# Altium project SpectrumAnalizer.PrjPcb (part 2 of 2)

## Sheet Analog.SchDoc
size A2
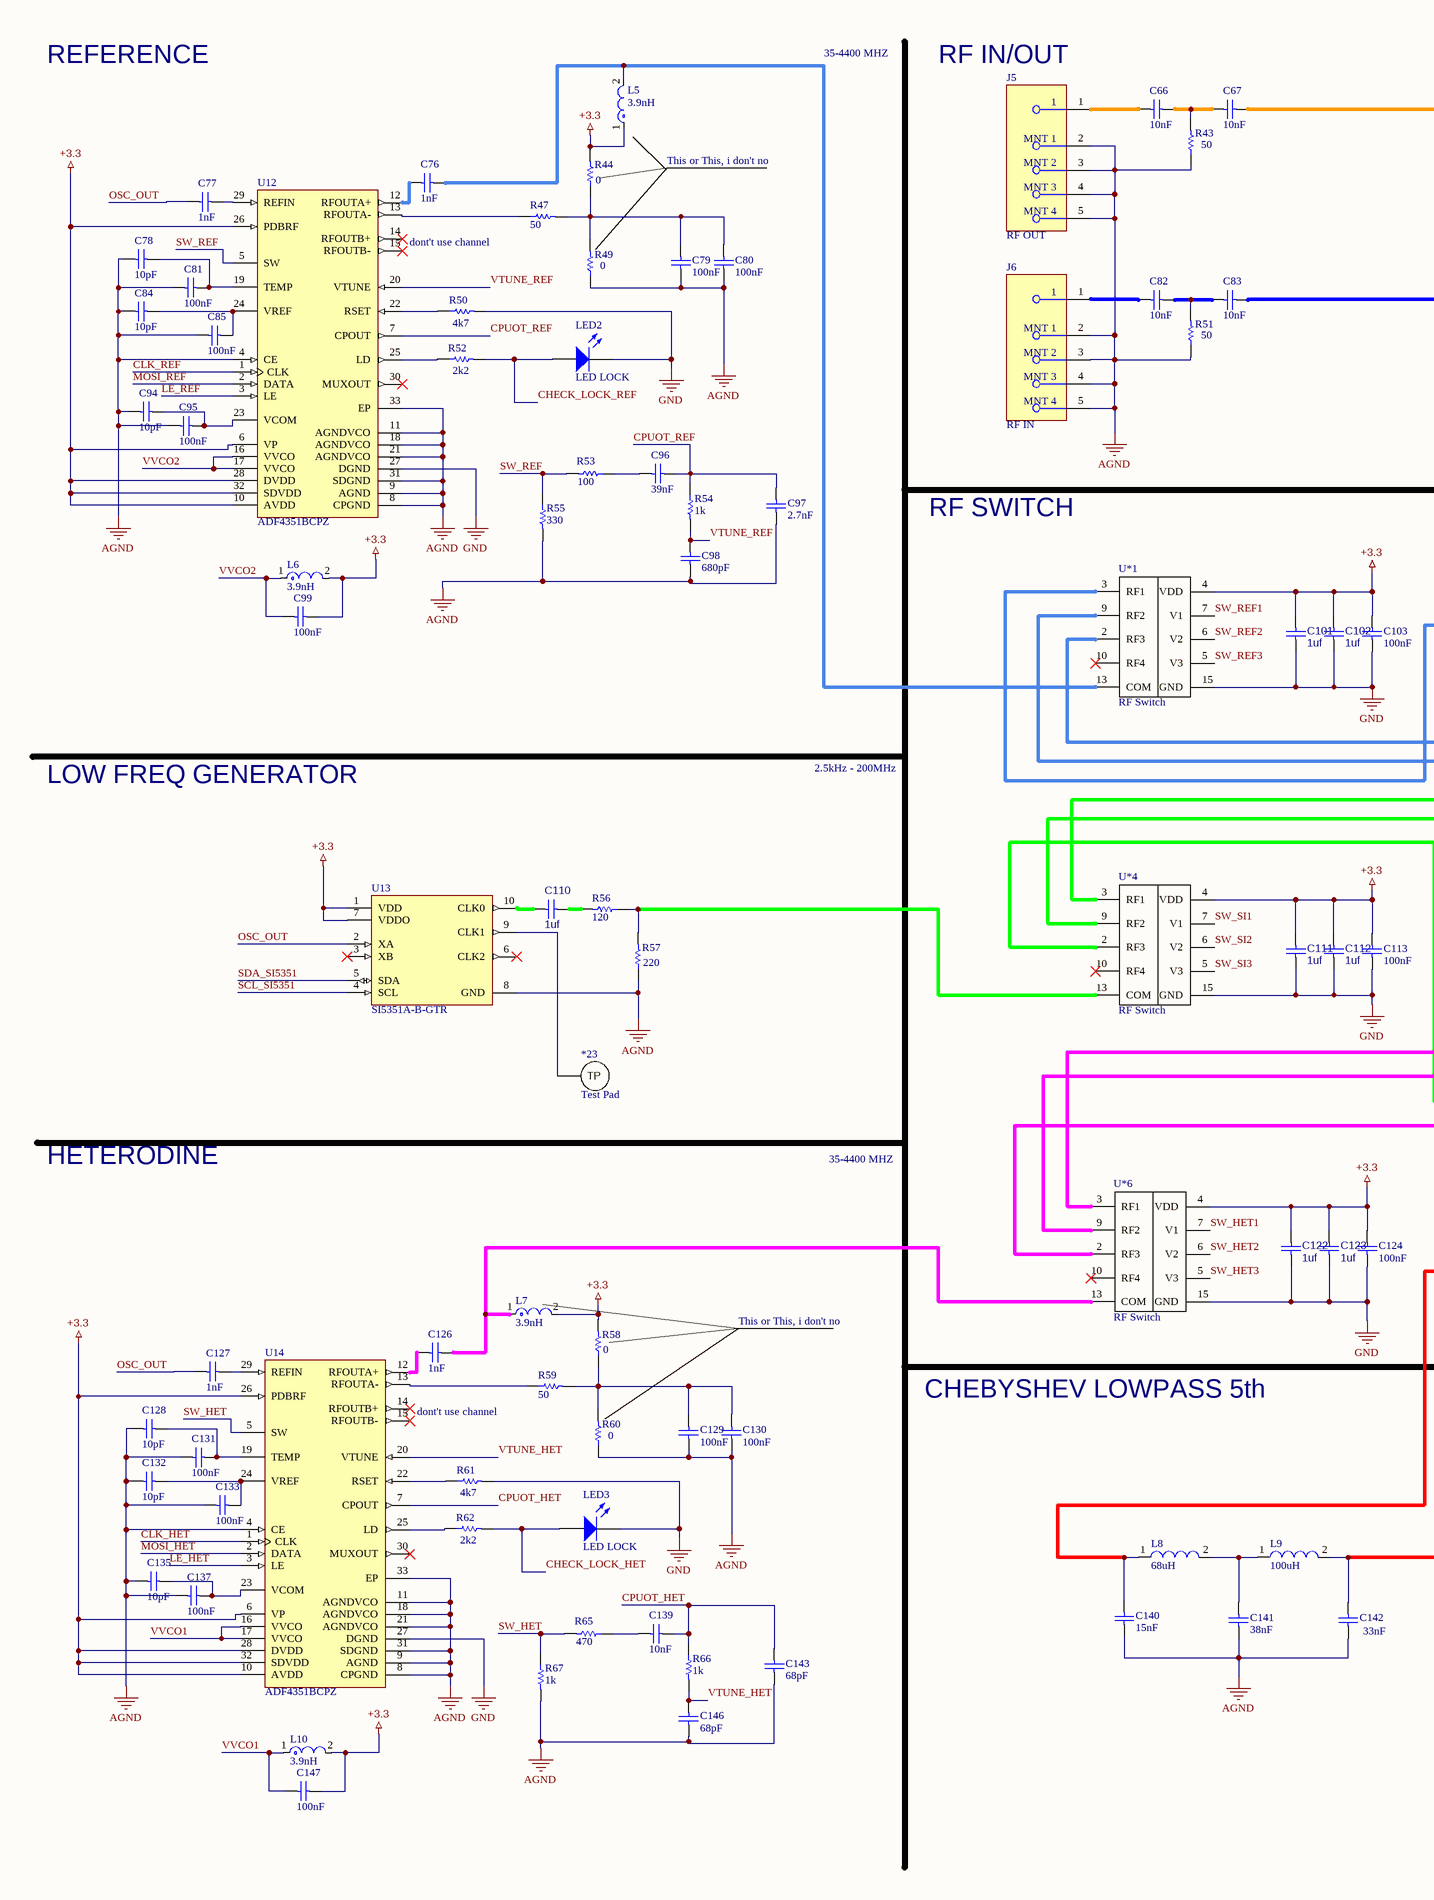
[diagram p3: Analog.SchDoc, left]
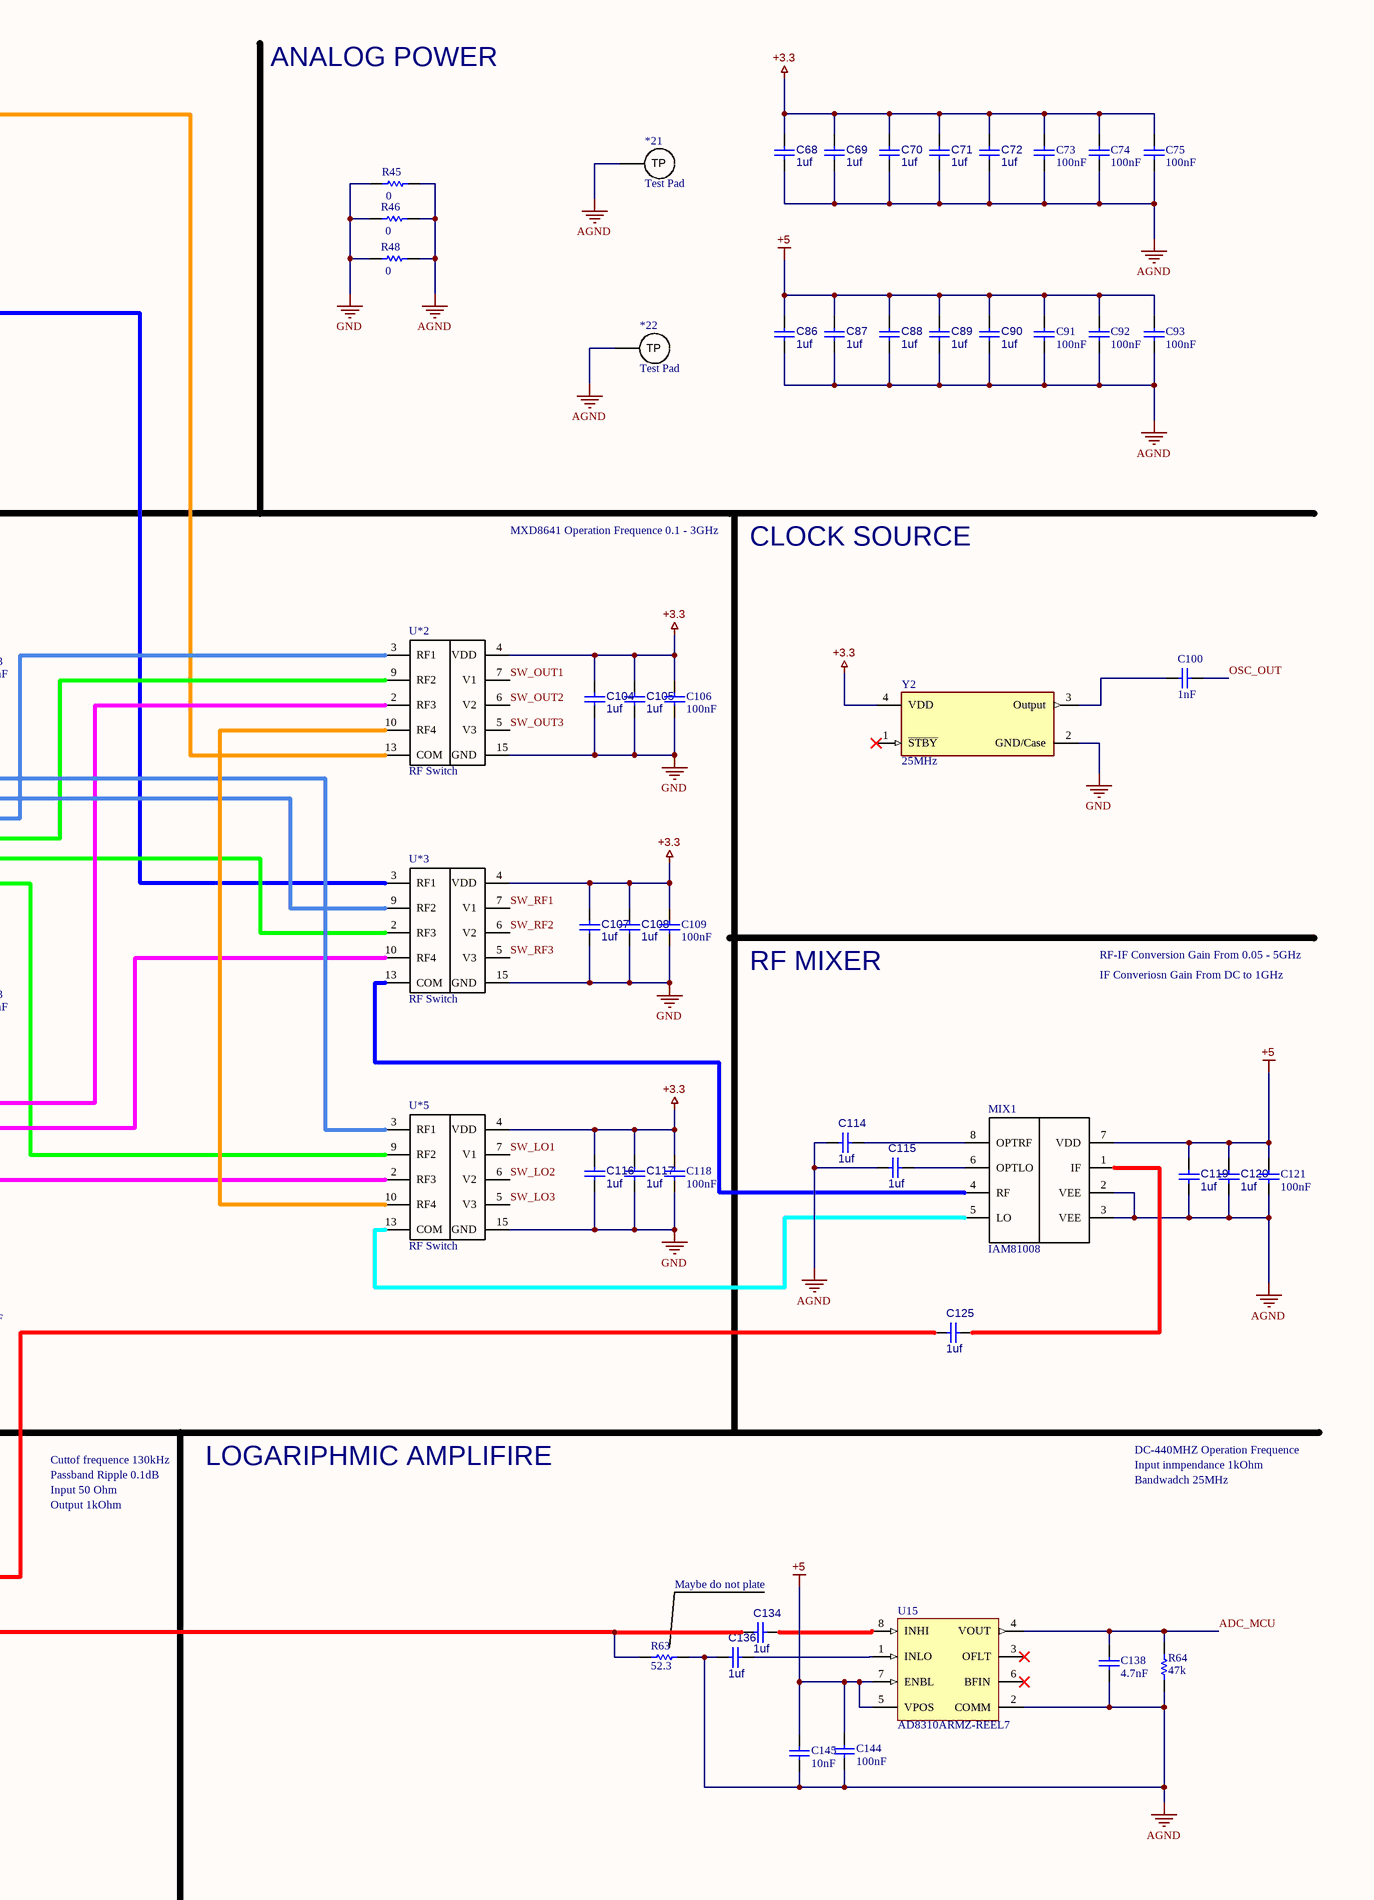
[diagram p4: Analog.SchDoc, right]

### Parts
*21  Test Pad  [Test Pad]
*22  Test Pad  [Test Pad]
*23  Test Pad  [Test Pad]
C66  10nF  [CAPC1608X90X35ML10T15]
C67  10nF  [CAPC1608X90X35ML10T15]
C68  1uf  [CAPC2013X70X45NL10T25]
C69  1uf  [CAPC2013X70X45NL10T25]
C70  1uf  [CAPC2013X70X45NL10T25]
C71  1uf  [CAPC2013X70X45NL10T25]
C72  1uf  [CAPC2013X70X45NL10T25]
C73  100nF  [CAPC1608X90X35ML10T15]
C74  100nF  [CAPC1608X90X35ML10T15]
C75  100nF  [CAPC1608X90X35ML10T15]
C76  1nF  [CAPC1608X90X35ML10T15]
C77  1nF  [CAPC1608X90X35ML10T15]
C78  10pF  [CAPC1608X90X35ML10T15]
C79  100nF  [CAPC1608X90X35ML10T15]
C80  100nF  [CAPC1608X90X35ML10T15]
C81  100nF  [CAPC1608X90X35ML10T15]
C82  10nF  [CAPC1608X90X35ML10T15]
C83  10nF  [CAPC1608X90X35ML10T15]
C84  10pF  [CAPC1608X90X35ML10T15]
C85  100nF  [CAPC1608X90X35ML10T15]
C86  1uf  [CAPC2013X70X45NL10T25]
C87  1uf  [CAPC2013X70X45NL10T25]
C88  1uf  [CAPC2013X70X45NL10T25]
C89  1uf  [CAPC2013X70X45NL10T25]
C90  1uf  [CAPC2013X70X45NL10T25]
C91  100nF  [CAPC1608X90X35ML10T15]
C92  100nF  [CAPC1608X90X35ML10T15]
C93  100nF  [CAPC1608X90X35ML10T15]
C94  10pF  [CAPC1608X90X35ML10T15]
C95  100nF  [CAPC1608X90X35ML10T15]
C96  39nF  [CAPC1608X90X35ML10T15]
C97  2.7nF  [CAPC1608X90X35ML10T15]
C98  680pF  [CAPC1608X90X35ML10T15]
C99  100nF  [CAPC1608X90X35ML10T15]
C100  1nF  [CAPC1608X90X35ML10T15]
C101  1uf  [CAPC2013X70X45NL10T25]
C102  1uf  [CAPC2013X70X45NL10T25]
C103  100nF  [CAPC1608X90X35ML10T15]
C104  1uf  [CAPC2013X70X45NL10T25]
C105  1uf  [CAPC2013X70X45NL10T25]
C106  100nF  [CAPC1608X90X35ML10T15]
C107  1uf  [CAPC2013X70X45NL10T25]
C108  1uf  [CAPC2013X70X45NL10T25]
C109  100nF  [CAPC1608X90X35ML10T15]
C110  1uf  [CAPC2013X70X45NL10T25]
C111  1uf  [CAPC2013X70X45NL10T25]
C112  1uf  [CAPC2013X70X45NL10T25]
C113  100nF  [CAPC1608X90X35ML10T15]
C114  1uf  [CAPC2013X70X45NL10T25]
C115  1uf  [CAPC2013X70X45NL10T25]
C116  1uf  [CAPC2013X70X45NL10T25]
C117  1uf  [CAPC2013X70X45NL10T25]
C118  100nF  [CAPC1608X90X35ML10T15]
C119  1uf  [CAPC2013X70X45NL10T25]
C120  1uf  [CAPC2013X70X45NL10T25]
C121  100nF  [CAPC1608X90X35ML10T15]
C122  1uf  [CAPC2013X70X45NL10T25]
C123  1uf  [CAPC2013X70X45NL10T25]
C124  100nF  [CAPC1608X90X35ML10T15]
C125  1uf  [CAPC2013X70X45NL10T25]
C126  1nF  [CAPC1608X90X35ML10T15]
C127  1nF  [CAPC1608X90X35ML10T15]
C128  10pF  [CAPC1608X90X35ML10T15]
C129  100nF  [CAPC1608X90X35ML10T15]
C130  100nF  [CAPC1608X90X35ML10T15]
C131  100nF  [CAPC1608X90X35ML10T15]
C132  10pF  [CAPC1608X90X35ML10T15]
C133  100nF  [CAPC1608X90X35ML10T15]
C134  1uf  [CAPC2013X70X45NL10T25]
C135  10pF  [CAPC1608X90X35ML10T15]
C136  1uf  [CAPC2013X70X45NL10T25]
C137  100nF  [CAPC1608X90X35ML10T15]
C138  4.7nF  [CAPC1608X90X35ML10T15]
C139  10nF  [CAPC1608X90X35ML10T15]
C140  15nF  [CAPC1608X90X35ML10T15]
C141  38nF  [CAPC1608X90X35ML10T15]
C142  33nF  [CAPC1608X90X35ML10T15]
C143  68pF  [CAPC1608X90X35ML10T15]
C144  100nF  [CAPC1608X90X35ML10T15]
C145  10nF  [CAPC1608X90X35ML10T15]
C146  68pF  [CAPC1608X90X35ML10T15]
C147  100nF  [CAPC1608X90X35ML10T15]
J5  RF OUT  [FP-73251-1350-MFG]
J6  RF IN  [FP-73251-1350-MFG]
L5  3.9nH  [FP-LQG18HH_00-MFG]
L6  3.9nH  [FP-LQG18HH_00-MFG]
L7  3.9nH  [FP-LQG18HH_00-MFG]
L8  68uH  [SMD-1210]
L9  100uH  [SMD-1210]
L10  3.9nH  [FP-LQG18HH_00-MFG]
LED2  LED LOCK  [0805_A]
LED3  LED LOCK  [0805_A]
MIX1  IAM81008  [IAM81008]
R43  50  [RESC1608X50X30NL20T20]
R44  0  [RESC1608X50X30NL20T20]
R45  0  [RESC1608X50X30NL20T20]
R46  0  [RESC1608X50X30NL20T20]
R47  50  [RESC1608X50X30NL20T20]
R48  0  [RESC1608X50X30NL20T20]
R49  0  [RESC1608X50X30NL20T20]
R50  4k7  [RESC1608X50X30NL20T20]
R51  50  [RESC1608X50X30NL20T20]
R52  2k2  [RESC1608X50X30NL20T20]
R53  100  [RESC1608X50X30NL20T20]
R54  1k  [RESC1608X50X30NL20T20]
R55  330  [RESC1608X50X30NL20T20]
R56  120  [RESC1608X50X30NL20T20]
R57  220  [RESC1608X50X30NL20T20]
R58  0  [RESC1608X50X30NL20T20]
R59  50  [RESC1608X50X30NL20T20]
R60  0  [RESC1608X50X30NL20T20]
R61  4k7  [RESC1608X50X30NL20T20]
R62  2k2  [RESC1608X50X30NL20T20]
R63  52.3  [RESC1608X50X30NL20T20]
R64  47k  [RESC1608X50X30NL20T20]
R65  470  [RESC1608X50X30NL20T20]
R66  1k  [RESC1608X50X30NL20T20]
R67  1k  [RESC1608X50X30NL20T20]
U12  ADF4351BCPZ  [ADI-CP-32-2_N]
U13  SI5351A-B-GTR  [FP-SI5351A-B-GTR-MFG]
U14  ADF4351BCPZ  [ADI-CP-32-2_N]
U15  AD8310ARMZ-REEL7  [ADI-RM-8_N]
U*1  RF Switch  [PCBComponent_1]
U*2  RF Switch  [PCBComponent_1]
U*3  RF Switch  [PCBComponent_1]
U*4  RF Switch  [PCBComponent_1]
U*5  RF Switch  [PCBComponent_1]
U*6  RF Switch  [PCBComponent_1]
Y2  25MHz  [FP-ASE-MFG]

### Nets
+3.3: C68.2 C69.2 C70.2 C71.2 C72.2 C73.2 C74.2 C75.2 C99.2 C101.2 C102.2 C103.2 C104.2 C105.2 C106.2 C107.2 C108.2 C109.2 C111.2 C112.2 C113.2 C116.2 C117.2 C118.2 C122.2 C123.2 C124.2 C147.2 L5.1 L6.2 L7.2 L10.2 R44.2 R58.2 U12.6(VP) U12.10(AVDD) U12.26(PDBRF) U12.28(DVDD) U12.32(SDVDD) U13.1(VDD) U13.7(VDDO) U14.6(VP) U14.10(AVDD) U14.26(PDBRF) U14.28(DVDD) U14.32(SDVDD) U*1.4(VDD) U*2.4(VDD) U*3.4(VDD) U*4.4(VDD) U*5.4(VDD) U*6.4(VDD) Y2.4(VDD)
+5: C86.2 C87.2 C88.2 C89.2 C90.2 C91.2 C92.2 C93.2 C119.2 C120.2 C121.2 C144.2 C145.2 MIX1.7(VDD) U15.5(VPOS) U15.7(ENBL)
AGND: *21.1(TP) *22.1(TP) C68.1 C69.1 C70.1 C71.1 C72.1 C73.1 C74.1 C75.1 C78.1 C79.1 C80.1 C81.1 C84.1 C85.1 C86.1 C87.1 C88.1 C89.1 C90.1 C91.1 C92.1 C93.1 C94.1 C95.1 C97.1 C98.1 C114.2 C115.2 C119.1 C120.1 C121.1 C128.1 C129.1 C130.1 C131.1 C132.1 C133.1 C135.1 C136.2 C137.1 C138.1 C140.1 C141.1 C142.1 C143.1 C144.1 C145.1 C146.1 J5.2(MNT_1) J5.3(MNT_2) J5.4(MNT_3) J5.5(MNT_4) J6.2(MNT_1) J6.3(MNT_2) J6.4(MNT_3) J6.5(MNT_4) MIX1.2(VEE) MIX1.3(VEE) R43.1 R45.2 R46.2 R48.2 R49.1 R51.1 R55.2 R57.1 R60.1 R63.2 R64.1 R67.2 U12.4(CE) U12.8(CPGND) U12.9(AGND) U12.11(AGNDVCO) U12.18(AGNDVCO) U12.21(AGNDVCO) U12.31(SDGND) U12.33(EP) U13.8(GND) U14.4(CE) U14.8(CPGND) U14.9(AGND) U14.11(AGNDVCO) U14.18(AGNDVCO) U14.21(AGNDVCO) U14.31(SDGND) U14.33(EP) U15.2(COMM)
GND: C101.1 C102.1 C103.1 C104.1 C105.1 C106.1 C107.1 C108.1 C109.1 C111.1 C112.1 C113.1 C116.1 C117.1 C118.1 C122.1 C123.1 C124.1 LED2.1(K) LED3.1(K) R45.1 R46.1 R48.1 R50.2 R61.2 U12.27(DGND) U14.27(DGND) U*1.15(GND) U*2.15(GND) U*3.15(GND) U*4.15(GND) U*5.15(GND) U*6.15(GND) Y2.2(GND/Case)
ADC_MCU: C138.2 R64.2 U15.4(VOUT)
CHECK_LOCK_HET: LED3.2(A) R62.2
CHECK_LOCK_REF: LED2.2(A) R52.2
CLK_HET: U12.1(CLK) U14.1(CLK)  [also labelled CLK_REF]
CPUOT_HET: C139.2 C143.2 R66.1 U14.7(CPOUT)
CPUOT_REF: C96.2 C97.2 R54.1 U12.7(CPOUT)
LE_HET: U14.3(LE)
LE_REF: U12.3(LE)
MOSI_HET: U12.2(DATA) U14.2(DATA)  [also labelled MOSI_REF]
OSC_OUT: C77.1 C100.2 C127.1 U13.2(XA)
SCL_SI5351: U13.4(SCL)
SDA_SI5351: U13.5(SDA)
SW_HET: R65.2 R67.1 U14.5(SW)
SW_HET1: U*6.7(V1)
SW_HET2: U*6.6(V2)
SW_HET3: U*6.5(V3)
SW_LO1: U*5.7(V1)
SW_LO2: U*5.6(V2)
SW_LO3: U*5.5(V3)
SW_OUT1: U*2.7(V1)
SW_OUT2: U*2.6(V2)
SW_OUT3: U*2.5(V3)
SW_REF: R53.2 R55.1 U12.5(SW)
SW_REF1: U*1.7(V1)
SW_REF2: U*1.6(V2)
SW_REF3: U*1.5(V3)
SW_RF1: U*3.7(V1)
SW_RF2: U*3.6(V2)
SW_RF3: U*3.5(V3)
SW_SI1: U*4.7(V1)
SW_SI2: U*4.6(V2)
SW_SI3: U*4.5(V3)
VTUNE_HET: C146.2 R66.2 U14.20(VTUNE)
VTUNE_REF: C98.2 R54.2 U12.20(VTUNE)
VVCO1: C147.1 L10.1 U14.16(VVCO) U14.17(VVCO)
VVCO2: C99.1 L6.1 U12.16(VVCO) U12.17(VVCO)
Net*23_1: *23.1(TP) U13.9(CLK1)
NetC66_1: C66.1 C67.2 R43.2
NetC66_2: C66.2 J5.1
NetC67_1: C67.1 U*2.13(COM)
NetC76_1: C76.1 U12.12(RFOUTA+)
NetC76_2: C76.2 L5.2 U*1.13(COM)
NetC77_2: C77.2 U12.29(REFIN)
NetC78_2: C78.2 C81.2 U12.19(TEMP)
NetC79_2: C79.2 C80.2 R44.1 R47.2 R49.2
NetC82_1: C82.1 C83.2 R51.2
NetC82_2: C82.2 J6.1
NetC83_1: C83.1 U*3.3(RF1)
NetC84_2: C84.2 C85.2 U12.24(VREF)
NetC94_2: C94.2 C95.2 U12.23(VCOM)
NetC96_1: C96.1 R53.1
NetC100_1: C100.1 Y2.3(Output)
NetC110_1: C110.1 R56.2
NetC110_2: C110.2 U13.10(CLK0)
NetC114_1: C114.1 MIX1.8(OPTRF)
NetC115_1: C115.1 MIX1.6(OPTLO)
NetC125_1: C125.1 MIX1.1(IF)
NetC125_2: C125.2 C140.2 L8.1
NetC126_1: C126.1 U14.12(RFOUTA+)
NetC126_2: C126.2 L7.1 U*6.13(COM)
NetC127_2: C127.2 U14.29(REFIN)
NetC128_2: C128.2 C131.2 U14.19(TEMP)
NetC129_2: C129.2 C130.2 R58.1 R59.2 R60.2
NetC132_2: C132.2 C133.2 U14.24(VREF)
NetC134_1: C134.1 U15.8(INHI)
NetC134_2: C134.2 C142.2 L9.2 R63.1
NetC135_2: C135.2 C137.2 U14.23(VCOM)
NetC136_1: C136.1 U15.1(INLO)
NetC139_1: C139.1 R65.1
NetC141_2: C141.2 L8.2 L9.1
NetMIX1_4: MIX1.4(RF) U*3.13(COM)
NetMIX1_5: MIX1.5(LO) U*5.13(COM)
NetR47_1: R47.1 U12.13(RFOUTA-)
NetR50_1: R50.1 U12.22(RSET)
NetR52_1: R52.1 U12.25(LD)
NetR56_1: R56.1 R57.2 U*4.13(COM)
NetR59_1: R59.1 U14.13(RFOUTA-)
NetR61_1: R61.1 U14.22(RSET)
NetR62_1: R62.1 U14.25(LD)
NetU*1_2: U*1.2(RF3) U*5.3(RF1)
NetU*1_3: U*1.3(RF1) U*2.3(RF1)
NetU*1_9: U*1.9(RF2) U*3.9(RF2)
NetU*2_2: U*2.2(RF3) U*6.3(RF1)
NetU*2_9: U*2.9(RF2) U*4.3(RF1)
NetU*2_10: U*2.10(RF4) U*5.10(RF4)
NetU*3_2: U*3.2(RF3) U*4.9(RF2)
NetU*3_10: U*3.10(RF4) U*6.9(RF2)
NetU*4_2: U*4.2(RF3) U*5.9(RF2)
NetU*5_2: U*5.2(RF3) U*6.2(RF3)

Not connected (* = marked no-connect by the designer): U12 14(RFOUTB+)* 15(RFOUTB-)* 30(MUXOUT)*; U13 3(XB)* 6(CLK2)*; U14 14(RFOUTB+)* 15(RFOUTB-)* 30(MUXOUT)*; U15 3(OFLT)* 6(BFIN)*; U*1 10(RF4)*; U*4 10(RF4)*; U*6 10(RF4)*; Y2 1(~{STBY})*

### Notes on the sheet
- REFERENCE
- 35-4400 MHZ
- (near J5) RF IN/OUT
- ANALOG POWER
- This or This, i don't no
- dont't use channel
- RF SWITCH
- MXD8641 Operation Frequence 0.1 - 3GHz
- CLOCK SOURCE
- 2.5kHz - 200MHz
- LOW FREQ GENERATOR
- RF MIXER
- RF-IF Conversion Gain From 0.05 - 5GHz
- IF Converiosn Gain From DC to 1GHz
- HETERODINE
- DC-440MHZ Operation Frequence
- CHEBYSHEV LOWPASS 5th
- Input 50 Ohm
- Output 1kOhm
- Cuttof frequence 130kHz
- Passband Ripple 0.1dB
- LOGARIPHMIC AMPLIFIRE
- Input inmpendance 1kOhm
- Bandwadch 25MHz
- (near C134) Maybe do not plate

### Library data of the parts
C66 C67 C82 C83 C139 C145 = CMP-2100-03642-1: Chip Capacitor, 10 nF, +/- 10%, 50 V, -55 to 125 degC, 0603 (1608 Metric), RoHS, Tape and Reel; Manufacturer: Murata; Insulation Resistance: 10GR; Dielectric: X7R; Voltage Rating: 50V; Material: Ceramic; Package Quantity: 1; Lead Free: LeadFree; Case/Package: 0603; Termination: SMD/SMT; REACH SVHC: Unknown; Manufacturer URL: http://www.murata.com/; Datasheet URL: http://search.murata.co.jp/Ceramy/image/img/A01X/G101/ENG/GRM188R71H103KA01-01.pdf; Mount: SurfaceMount; Datasheet Version: 42401.0; Number of Pins: 2; Length: 1.6mm; Voltage: 50V; Depth: 0.8mm; Tolerance: 10%; Min Operating Temperature: -55degC; Voltage Rating (DC): 50V; Max Operating Temperature: 125degC; Package Description: 2-Pin Surface Mount Device, Body 1.6 x 0.8 mm; RoHSCompliant: True; Case Code (Imperial): 0603; Width: 0.031inch; Case Code (Metric): 1608; Height: 0.8mm; Package Reference: 0603; Packaging: TapeandReel; Thickness: 0.035inch; Capacitance: 10nF; Dielectric Material: Ceramic
C68-C72 C86-C90 C101 C102 C104 C105 C107 C108 C110-C112 C114-C117 C119 C120 C122 C123 C125 C134 C136 = CMP-2007-00957-1: Part Number: GRM216R61E105KA12D; Manufacturer: Murata
C73-C81 C84 C85 C91-C100 C103 C106 C109 C113 C118 C121 C124 C126-C133 C135 C137 C138 C140-C144 C146 C147 = CMP-2100-03642-1: Chip Capacitor, 10 nF, +/- 10%, 50 V, -55 to 125 degC, 0603 (1608 Metric), RoHS, Tape and Reel; Manufacturer: Murata; Insulation Resistance: 10GR; Dielectric: X7R; Voltage Rating: 50V; Capacitance: 10nF; Material: Ceramic; Package Quantity: 1; Lead Free: LeadFree; Case/Package: 0603; Termination: SMD/SMT; REACH SVHC: Unknown; Manufacturer URL: http://www.murata.com/; Datasheet URL: http://search.murata.co.jp/Ceramy/image/img/A01X/G101/ENG/GRM188R71H103KA01-01.pdf; Mount: SurfaceMount; Datasheet Version: 42401.0; Number of Pins: 2; Length: 1.6mm; Voltage: 50V; Depth: 0.8mm; Tolerance: 10%; Min Operating Temperature: -55degC; Voltage Rating (DC): 50V; Max Operating Temperature: 125degC; Package Description: 2-Pin Surface Mount Device, Body 1.6 x 0.8 mm; RoHSCompliant: True; Case Code (Imperial): 0603; Width: 0.031inch; Case Code (Metric): 1608; Height: 0.8mm; Package Reference: 0603; Packaging: TapeandReel; Thickness: 0.035inch; Dielectric Material: Ceramic
J5 J6 = CMP-04764-000006-1: CONN SMA JACK STR 50 OHM SMD; Manufacturer Part Number: 73251-1350; Manufacturer: Molex; Is Female: yes; Standoff Height: 0.41mm; Impedance: 50Ω; Number Of Contacts: 1; Conn Orientation: Straight; Voltage Rating: 500V; Shielding: true; Frequency: 18GHz; Package: 73251-1350; Device Class L1: Connectors; Category: Conn; ComponentLink2URL: https://www.molex.com/pdm_docs/sd/732511350_sd.pdf; Automotive: No; Height: 9.655mm; Octopart: https://octopart.com/73251-1350-molex-5414390; Footprint Url: https://forum.upverter.com/uploads/default/original/3X/d/a/daeafa2ce4908d4fc4e49f0b17d7d2c986fce444.pdf; Temperature Range High: +165°C; Device Class L3: unset; Mouser Description: RF Connectors / Coaxial Connectors SMA ST PCB-JCK STD SMT; Lead Free: Yes; Temperature: -65°C to +165°C; RoHS: TRUE; ComponentLink2Description: Datasheet; Device Class L2: RF / Coaxial Connectors; Digikey Description: CONN SMA JACK STR 50 OHM SMD; Contact Material: Gold; Temperature Range Low: -65°C
L5-L7 L10 = CMP-06042-004616-1: Multilayer type RF Inductor 10nH ±5% 0.3Ω 650mA 0603; Test Frequency: 100MHz; Current: 35mA; DC Resistance (DCR): 300mR; Q Factor: 12; DC Current: 400mA; Self Resonant Frequency: 3.5GHz; Core Material: Air; Shielding: Unshielded; Radiation Hardening: No; Case Code (Metric): 1608; Min Operating Temperature: -40°C; Inductance: 10nH; Inductance Tolerance: 5%; Case Code (Imperial): 0603; Termination: SMD/SMT; Height: 0.8mm; Packaging: Tape and Reel; Width: 0.031inch; Military Standard: Not; Max DC Current: 400mA; Max Operating Temperature: 85°C; Package Quantity: 4000; Depth: 0.95mm; Lead Free: Lead Free; Current Rating: 400mA; Mount: Surface Mount; Tolerance: 5%; Case/Package: 0603; REACH SVHC: No SVHC; Length: 1.6mm
L8 L9 = CMP-0221-00030-1: SMD-Multilayer Inductor WE-MI, L = 10.00 µH; Inductance: 10.00 ÂµH; ComponentLink2URL: http://www.we-online.de/katalog/media/pdf/7447918.pdf; ComponentLink1Description: Manufacturer Link; PackageVersion: 2007; DatasheetVersion: ver 5, Oct-2004; PackageReference: SMD-1210; ComponentLink1URL: http://www.we-online.com; PackageDescription: Chip Inductor, 2-Leads, Body 3.2 x 2.5 mm; ComponentLink2Description: Datasheet
LED2 LED3 = CMP-1426-00011-1: SMD mono-color Chip LED, WL-SMCW, Red; PartNumber: 150080RS75000; Manufacturer: Wuerth Elektronik; Color: Red; PackageReference: 0805_A; ComponentLink2Description: Datasheet; ComponentLink1URL: http://www.we-online.com; ComponentLink1Description: Manufacturer URL; ComponentLink2URL: http://katalog.we-online.com/led/datasheet/150080RS75000.pdf
R43-R67 = CMP-2000-02744-1: Part Number: RR0816P-753-B-T5; Manufacturer: Susumu
U12 U14 = CMP-0287-00014-1: Wideband Synthesizer with Integrated VCO, CP-32-2, Pb-Free, 490 Tray; Norm Phase Noise (dBc/Hz): -221dBc; Single/Dual: Single; Supply Current: 110mA; Max REFin (MHz): 250MHz; Max RF Input (MHz): 4.4GHz; Frequency Range: 35MHz-4.4GHz; RF Prescalers: 4/5,8/9; ComponentLink2URL: http://www.analog.com/static/imported-files/data_sheets/ADF4351.pdf; ComponentLink1URL: www.analog.com; ComponentLink1Description: Manufacturer URL; PackageDescription: 32-Lead Lead Frame Chip Scale Package [LFCSP_VQ]; Code_JEDEC: MO-220-VHHD-2; DatasheetVersion: Rev. Pr D; ComponentLink3URL: http://www.analog.com/static/imported-files/packages/414143737956480539664569CP_32_2.pdf; PackageReference: CP-32-2; PackageVersion: Jan-2005; ComponentLink2Description: Datasheet; ComponentLink3Description: Package Specification
U13 = CMP-08072-000001-1: IC CLK GENERATOR 200MHZ 10MSOP; PLL: Yes; Number of Circuits: 2; Max Duty Cycle: 55%; Operating Supply Voltage: 3.3V; Input: Crystal; Number of Outputs: 3; Operating Supply Current: 22mA; Packaging: Tape and Reel; Max Frequency: 200MHz; Min Operating Temperature: -40°C; Case/Package: MSOP; Mount: Surface Mount; Max Operating Temperature: 85°C; RoHS Compliant: Yes; Series: MultiSynth™; Number of Pins: 10; Package Quantity: 2500
U15 = CMP-0284-00103-1: Fast, Voltage-Out, DC to 440 MHz, 95 dB Logarithmic Amplifier, 15ns Response Time, RM-8, Pb-Free, 1000 Reel; Dynamic Range (dB): 100dB; Temp Stability (dB): 1dB; Supply Current: 8mA; Voltage Supply (V): 2.7 to 5.5; Product Description: High Dynamic Range; PackageReference: RM-8; ComponentLink2Description: Datasheet; PackageVersion: Aug-2005; RF Frequency (MHz): dc to 440; ComponentLink3URL: http://www.analog.com/static/imported-files/packages/PKG_PDF/MSOP%28RM%29/RM_8.pdf; Response Time (ns typ): 15ns; DatasheetVersion: Rev. F; PackageDescription: 8-Lead Mini Small Outline Package [MSOP]; ComponentLink1Description: Manufacturer URL; Code_JEDEC: MO-187-AA; ComponentLink1URL: www.analog.com; ComponentLink3Description: Package Specification; ComponentLink2URL: http://www.analog.com/static/imported-files/data_sheets/AD8310.pdf
U*1-U*6 = MXD8641
Y2 = CMP-27762-010648-1: XTAL Oscillator 33.333MHz ±50ppm CMOS 3.3V 4-SMD 3.2mm x 2.5mm; Max Supply Voltage: 3.465V; Load Capacitance: 15pF; Min Supply Voltage: 3.135V; Max Supply Current: 13mA; Package Quantity: 1000; Frequency: 33.333MHz; Radiation Hardening: No; Case/Package: SMD/SMT; REACH SVHC: No SVHC; Max Operating Temperature: 85°C; Operating Supply Voltage: 3.3V; Depth: 2.5mm; Height: 0.047inch; Mount: Surface Mount; Lead Free: Lead Free; Width: 0.098inch; Packaging: Tape and Reel; Operating Frequency: 33.333 MHz; Series: ASE; Termination: SMD/SMT; Min Operating Temperature: -40°C; Frequency Stability: 50ppm; Number of Pins: 4; Length: 3.2mm
MIX1 = IAM81008: ComponentLink1Description: https://www.chipfind.ru/datasheet/agilent/iam81008.htm; ComponentLink1URL: *

## Nets that join several sheets
+3.3: MCU (45 pins), Power (10 pins), LCD (11 pins), Analog (53 pins)
+5: Power (12 pins), Analog (16 pins)
+VL: Power (5 pins), LCD (J1.1 J1.2)
AVDD_LCD: Power (7 pins), LCD (J1.43)
GND: MCU (52 pins), Power (53 pins), LCD (15 pins), Analog (34 pins)
VCOM_LCD: Power (C38.2 U7.13), LCD (J1.6 J1.46)
VGH_LCD: Power (6 pins), LCD (J1.41)
VGL_LCD: Power (6 pins), LCD (J1.42)
ADC_MCU: MCU (U3.34), Analog (C138.2 R64.2 U15.4)
CHECK_LOCK_HET: MCU (U3.118), Analog (LED3.2 R62.2)
CHECK_LOCK_REF: MCU (U3.119), Analog (LED2.2 R52.2)
CLK_HET: MCU (U3.74), Analog (U12.1 U14.1)
LCD_B0: MCU (U3.3), LCD (J1.19)
LCD_B1: MCU (U3.127), LCD (J1.18)
LCD_B2: MCU (U3.122), LCD (J1.17)
LCD_B3: MCU (U3.126), LCD (J1.16)
LCD_B4: MCU (U3.102), LCD (J1.15)
LCD_B5: MCU (U3.37), LCD (J1.14)
LCD_B6: MCU (U3.139), LCD (J1.13)
LCD_B7: MCU (U3.140), LCD (J1.12)
LCD_CLK: MCU (U3.92), LCD (J1.37)
LCD_DE: MCU (U3.22), LCD (J1.9)
LCD_ENABLE: MCU (U3.98), Power (R15.2)
LCD_G0: MCU (U3.4), LCD (J1.27)
LCD_G1: MCU (U3.5), LCD (J1.26)
LCD_G2: MCU (U3.42), LCD (J1.25)
LCD_G3: MCU (U3.99), LCD (J1.24)
LCD_G4: MCU (U3.69), LCD (J1.23)
LCD_G5: MCU (U3.70), LCD (J1.22)
LCD_G6: MCU (U3.97), LCD (J1.21)
LCD_G7: MCU (U3.117), LCD (J1.20)
LCD_HS: MCU (U3.96), LCD (J1.11)
LCD_L/R: MCU (U3.75), LCD (J1.39)
LCD_R0: MCU (U3.128), LCD (J1.35)
LCD_R1: MCU (U3.36), LCD (J1.34)
LCD_R2: MCU (U3.35), LCD (J1.33)
LCD_R3: MCU (U3.46), LCD (J1.32)
LCD_R4: MCU (U3.41), LCD (J1.31)
LCD_R5: MCU (U3.101), LCD (J1.30)
LCD_R6: MCU (U3.47), LCD (J1.29)
LCD_R7: MCU (U3.91), LCD (J1.28)
LCD_RESET: MCU (U3.43), LCD (J1.44 R1.2)
LCD_U/D: MCU (U3.76), LCD (J1.40)
LCD_VS: MCU (U3.40), LCD (J1.10)
LE_HET: MCU (U3.7), Analog (U14.3)
LE_REF: MCU (U3.8), Analog (U12.3)
MOSI_HET: MCU (U3.27), Analog (U12.2 U14.2)
PWM_LED_DISPLAYED: MCU (U3.100), Power (U9.4)
SCL_SI5351: MCU (R5.1 U3.81), Analog (U13.4)
SDA_SI5351: MCU (R4.1 U3.82), Analog (U13.5)
SW_HET1: MCU (RN3.7), Analog (U*6.7)
SW_HET2: MCU (RN3.6), Analog (U*6.6)
SW_HET3: MCU (RN3.5), Analog (U*6.5)
SW_LO1: MCU (RN1.8), Analog (U*5.7)
SW_LO2: MCU (RN1.7), Analog (U*5.6)
SW_LO3: MCU (RN1.6), Analog (U*5.5)
SW_OUT1: MCU (RN2.6), Analog (U*2.7)
SW_OUT2: MCU (RN2.5), Analog (U*2.6)
SW_OUT3: MCU (RN3.8), Analog (U*2.5)
SW_REF1: MCU (RN4.5), Analog (U*1.7)
SW_REF2: MCU (RN5.8), Analog (U*1.6)
SW_REF3: MCU (RN5.7), Analog (U*1.5)
SW_RF1: MCU (RN1.5), Analog (U*3.7)
SW_RF2: MCU (RN2.8), Analog (U*3.6)
SW_RF3: MCU (RN2.7), Analog (U*3.5)
SW_SI1: MCU (RN4.8), Analog (U*4.7)
SW_SI2: MCU (RN4.7), Analog (U*4.6)
SW_SI3: MCU (RN4.6), Analog (U*4.5)